# Altium project CubeSatTelemetry2.PrjPcb (part 1 of 2)
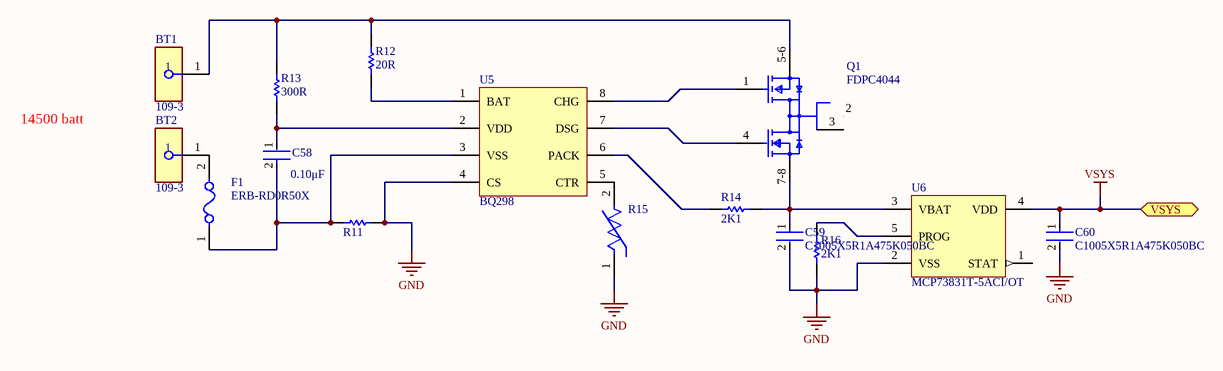
[diagram p0: BMS.SchDoc]
13 sheets, 176 parts. Net scope: hierarchical (ports join the sheet entries above them; power ports are global).
Board file: RocketModule.PcbDoc
Sheets:
  BMS.SchDoc
  TopLevel.SchDoc
    U_MCUsubsystem = MCUsubsystem.SchDoc
      U_MCUReset = MCUReset.SchDoc
    U_SerialConnector = SerialConnector.SchDoc
    U_LoRaSubsystem = LoRaSubsystem.SchDoc
    U_LTEMSubsystem = LTEMSubsystem.SchDoc
    U_MicroSDcard = MicroSDcard.SchDoc
    U_PowerSubsystem = PowerSubsystem.SchDoc
      Repeat(DCDC ,1,2)) = DCDC_Converter.SchDoc
    U_PreciseGNSS = PreciseGNSS.SchDoc
    U_RoughGNSS = RoughGNSS.SchDoc
    U_UWBSubsystem = UWBSubsystem.SchDoc

## Sheet BMS.SchDoc
size A4; SheetNumber: 9; SheetTotal: 14

### Parts
BT1  109-3  [FP-109-3-MFG]
BT2  109-3  [FP-109-3-MFG]
C58  Capacitance: 0.10μF  [FP-GRM15-MFG]  (hidden comment: GRM155R71C104KA88D)
C59  C1005X5R1A475K050BC  [FP-C1005-050-0_15-MFG]
C60  C1005X5R1A475K050BC  [FP-C1005-050-0_15-MFG]
F1  ERB-RD0R50X  [FP-ERBRD-MFG]
Q1  FDPC4044  [FP-483BP-MFG]
R11  ERJ-2BSFR10X  [RESC1005X40X27LL10T10]  (value not drawn)
R12  20R  [RESC1005X40X25LL05T10]
R13  300R  [RESC1005X35X20ML05T10]
R14  2K1  [RESC1005X40X25NL05T05]
R15  NCP15XH103F03RC  [FP-NCP15-NCU15-0_05-IPC_C]  (value not drawn)
R16  2K1  [RESC1005X40X25NL05T05]
U5  BQ298  [thingio]
U6  MCP73831T-5ACI/OT  [SOT-23-OT5_N]

### Ports
VSYS (bidir, see PowerSubsystem[2B], DCDC_Converter[2B])

### Nets
GND: C59.2 C60.2 R11.1 R15.1 R16.1 U5.4(CS) U6.2(VSS)
VSYS: C60.1 U6.4(VDD) ; port VSYS
NetBT1_1: BT1.1 Q1.5-6(S1) R12.2 R13.2
NetBT2_1: BT2.1 F1.2
NetC58_1: C58.1 R13.1 U5.2(VDD)
NetC58_2: C58.2 F1.1 R11.2 U5.3(VSS)
NetC59_1: C59.1 Q1.7-8(S2) R14.2 U6.3(VBAT)
NetQ1_1: Q1.1(G1) U5.8(CHG)
NetQ1_4: Q1.4(G2) U5.7(DSG)
NetR12_1: R12.1 U5.1(BAT)
NetR14_1: R14.1 U5.6(PACK)
NetR15_2: R15.2 U5.5(CTR)
NetR16_2: R16.2 U6.5(PROG)

Not connected (* = marked no-connect by the designer): Q1 2(D1) 3(D2); U6 1(STAT)

### Notes on the sheet
- 14500 batt

### Library data of the parts
BT1 BT2 = CMP-19636-000033-1: BATT CONTACT SPRING MULTI PC PIN; Number of Batteries: 2; Lead Free: Lead Free; Color: Black; Package Quantity: 100; Reach SVHC Compliant: Yes; Max Operating Temperature: 145°C; RoHS Compliant: Yes; Mount: Surface Mount; Termination: SMD/SMT; Min Operating Temperature: -50°C; Case/Package: SMD/SMT; Series: -
C58 = CMP-2100-03641-2: CAP CER 0.1UF 16V X7R 0402; Manufacturer: Murata; Standoff Height: 0mm; Tolerance: 10%; Voltage Rating: 16Vdc; Material: Ceramic; Value: 0.10μF; RoHS: TRUE; Manufacturer Part Number: GRM155R71C104KA88D; Temperature Characteristic: X7R; Octopart: https://octopart.com/grm155r71c104ka88d-murata-196880; Digikey Description: CAP CER 0.1UF 16V X7R 0402; Device Class L3: Ceramic Capacitors; Height: 0.55mm; ComponentLink2Description: Datasheet; Temperature Range Low: -55°C; Ipc Land Pattern Name: CAPC10050X219; ComponentLink2URL: https://search.murata.co.jp/Ceramy/image/img/A01X/G101/ENG/GRM155R71H471KA01-01A.pdf; Device Class L1: Passive Components; Lead Free: yes; Category: Cap; Package: GRM15; Temperature: -55°C to +125°C; Device Class L2: Capacitors; Temperature Range High: +125°C; Mouser Description: 0402 0.1 uF 16V ±10 % Tolerance X7R SMT Multilayer Ceramic Capacitor
C59 C60 = CMP-2000-05997-2: CAP CER 4.7UF 10V X5R 0402; Dielectric Material: Ceramic; Tolerance: 10%; Series: C; Package Quantity: 10000; Max Operating Temperature: 85°C; Case Code (Imperial): 0402; Lead Free: Lead Free; Voltage Rating (DC): 10V; Packaging: Cut Tape; Voltage Rating: 10V; Min Operating Temperature: -55°C; Dielectric: X5R; Thickness: 0.022inch; Width: 0.02inch; Case/Package: 0402; Case Code (Metric): 1005; Capacitance: 4.7uF; Length: 0.039inch; RoHS Compliant: Yes; REACH SVHC: No SVHC; Mount: Surface Mount
F1 = CMP-05590-000002-1: FUSE BOARD MNT 500MA 32VDC 0402; Manufacturer: Panasonic Electronic Components; Fuse Current: 0.5A; Fuse Blow Speed: Fast; Voltage Rating: 32V; Value: 310mΩ; Fuse Interrupt Dc Current: 35A; Description: 500mA AC 32V DC Fuse Board Mount (Cartridge Style Excluded) Surface Mount 0402 (1005 Metric); RoHS: TRUE; ComponentLink2Description: Datasheet; Temperature Range High: +125°C; Temperature: -40°C to +125°C; Mouser Description: Fuse Chip Fast Acting 0.5A 32V SMD Solder Pad 0402 1 X 0.5 X 0.39mm T/R UL/cUL; Digikey Description: FUSE BOARD MNT 500MA 32VDC 0402; Device Class L2: Fuses; Temperature Range Low: -40°C; Ipc Land Pattern Name: CAPC10050X39; Octopart: https://octopart.com/erb-rd0r50x-panasonic-21220527; Category: Fuse; Automotive: No; Device Class L3: unset; Lead Free: Yes; Package: ERBRD; Max Fuse Dc Voltage: 32V; Device Class L1: Circuit Protection; Manufacturer Part Number: ERB-RD0R50X; ComponentLink2URL: https://industrial.panasonic.com/cdbs/www-data/pdf/AFA0000/AFA0000C7.pdf; Height: 0.49mm; Resistance: 310mΩ
Q1 = CMP-07173-000013-1: MOSFET 2N-CH 8MLP; Manufacturer: ON Semiconductor; Max Forward Diode Voltage: 1.2V; Transconductance: 150S; Power Dissipation: 1W; Typ Forward Diode Voltage: 0.8V; Depletion Mode: False; Drain To Source Resistance: 3.2mΩ; Drain To Source Breakdown Voltage: 30V; Number Of N Channels: 2; Turn Off Delay Time: 32ns; Continuous Drain Current: 27A; Threshold Vgs Max: 3V; Turn On Delay Time: 8.5ns; Gate To Source Voltage: 20V; Max Junction Temp: +150°C; Standoff Height: 0mm; Rthja Max: 127°C/W; Gate Charge At Vgs: 35nC @ 10V; Mouser Description: MOSFET Common Drain N-Chan Power Trench MOSFET; Package: 483BP; Octopart: https://octopart.com/fdpc4044-on+semiconductor-84326487; Footprint Url: https://www.onsemi.com/pub/Collateral/483BP.PDF; Device Class L2: Transistors; Temperature Range Low: -55°C; Device Class L1: Discrete Semiconductors; Number Of Channels: 2; Temperature: -55°C to +150°C; Category: Trans; Manufacturer Part Number: FDPC4044; RoHS: TRUE; Device Class L3: MOSFETs; Height: 0.8mm; Temperature Range High: +150°C; Lead Free: Yes; ComponentLink2URL: https://www.onsemi.com/pub/Collateral/FDPC4044-D.PDF; Automotive: No; Threshold Vgs Min: 1.2V; ComponentLink2Description: Datasheet; Digikey Description: MOSFET 2N-CH 8MLP
R11 = CMP-2002-04635-1: Manufacturer: Panasonic; Part Number: ERJ-2BSFR10X
R12 = CMP-2002-07502-1: Part Number: RC0402FR-0720RL; Manufacturer: Yageo / Phycomp
R13 = CMP-2002-03249-1: Part Number: CPF0402B300RE1; Manufacturer: TE Connectivity / AMP
R14 R16 = CMP-2002-08450-1: Part Number: CRCW04022K10FKED; Manufacturer: Vishay Dale
R15 = CMP-06022-000003-3: NTC Thermistor for Temperature Sensor, 0402, 10kΩ, 1%, 0.1mA, 5V; Max Power Dissipation: 100mW; Resistance: 10kR; Current Rating: 310uA; Length: 1mm; Min Operating Temperature: -40°C; Max Operating Temperature: 125°C; Resistance Tolerance: 1%; Lead Free: Lead Free; Radiation Hardening: No; Case Code (Imperial): 0402; Depth: 0.5mm; Tolerance: 1%; Packaging: Tape and Reel; Package Quantity: 10000; Series: NCP; Number of Pins: 2; Power Rating: 100mW; Case/Package: 0402; Case Code (Metric): 1005; Height: 0.5mm; Termination: SMD/SMT; RoHS Compliant: Yes; REACH SVHC: No SVHC; Mount: Surface Mount
U5 = BQ298: BQ298xyz Voltage, Current, Temperature Protectors with an Integrated High-Side / NFET Driver for Fast/Flash Charging Single-Cell Li-Ion and Li-Polymer Batteries
U6 = CMP-0133-00136-1: Miniature Single-Cell, Fully Integrated Li-Ion, Li-Polymer Charge Management Controller, 4.5V, 5-Pin SOT-23, Industrial Temperature, Tape and Reel; PackageReference: SOT-23-OT5; PackageDescription: 5-Lead Plastic Small Outline Transistor (OT) [SOT-23]; PackageVersion: revBB, Aug-2009; DatasheetVersion: revE, Sep-2008; Code_IPC: SOT23-5

## Sheet TopLevel.SchDoc
size A4; SheetNumber: 1; SheetTotal: 13
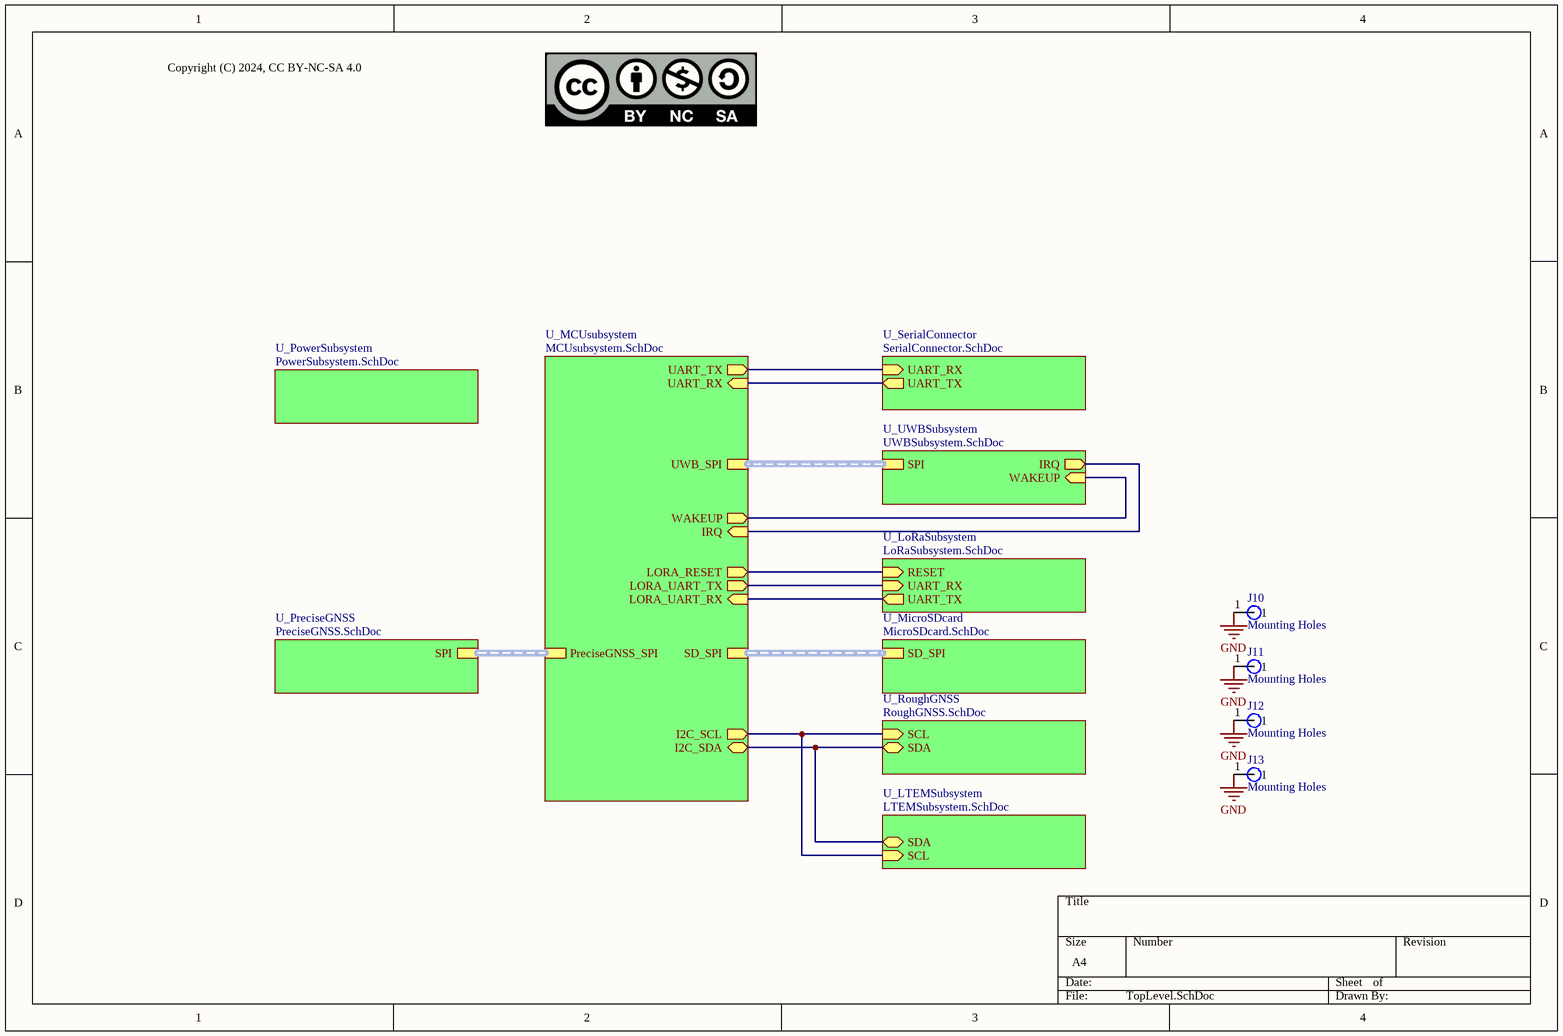
[diagram p1: TopLevel.SchDoc]

### Parts
J10  Mounting Holes  [Mounting Hole]
J11  Mounting Holes  [Mounting Hole]
J12  Mounting Holes  [Mounting Hole]
J13  Mounting Holes  [Mounting Hole]

### Sub-sheets
U_LoRaSubsystem = LoRaSubsystem.SchDoc: UART_RX (in), UART_TX (out), RESET (in)
U_LTEMSubsystem = LTEMSubsystem.SchDoc: SDA (bidir), SCL (in)
U_MCUsubsystem = MCUsubsystem.SchDoc: UART_RX (in), UART_TX (out), UWB_SPI (harness SPI), LORA_UART_TX (out), LORA_UART_RX (in), PreciseGNSS_SPI (harness SPI), SD_SPI (harness SPI), LORA_RESET (out), I2C_SDA (bidir), I2C_SCL (out), WAKEUP (out), IRQ (in)
U_MicroSDcard = MicroSDcard.SchDoc: SD_SPI (harness SPI)
U_PowerSubsystem = PowerSubsystem.SchDoc: no entries
U_PreciseGNSS = PreciseGNSS.SchDoc: SPI (harness SPI)
U_RoughGNSS = RoughGNSS.SchDoc: SCL (in), SDA (bidir)
U_SerialConnector = SerialConnector.SchDoc: UART_RX (in), UART_TX (out)
U_UWBSubsystem = UWBSubsystem.SchDoc: SPI (harness SPI), IRQ (out), WAKEUP (in)

### Nets
GND: J10.1 J11.1 J12.1 J13.1
NetMD2_2: sheet U_MCUsubsystem/WAKEUP, sheet U_UWBSubsystem/WAKEUP
NetMD2_22: sheet U_MCUsubsystem/IRQ, sheet U_UWBSubsystem/IRQ
NetP1_1: sheet U_MCUsubsystem/UART_RX, sheet U_SerialConnector/UART_TX
NetR26_1: sheet U_MCUsubsystem/LORA_UART_TX, sheet U_LoRaSubsystem/UART_RX
NetR27_2: sheet U_MCUsubsystem/LORA_RESET, sheet U_LoRaSubsystem/RESET
NetR28_1: sheet U_MCUsubsystem/LORA_UART_RX, sheet U_LoRaSubsystem/UART_TX
NetR39_2: sheet U_MCUsubsystem/I2C_SDA, sheet U_LTEMSubsystem/SDA, sheet U_RoughGNSS/SDA
NetR40_2: sheet U_MCUsubsystem/I2C_SCL, sheet U_LTEMSubsystem/SCL, sheet U_RoughGNSS/SCL
NetU1#1_39: sheet U_MCUsubsystem/UART_TX, sheet U_SerialConnector/UART_RX

### Buses and harness runs
harness sheet U_MCUsubsystem/PreciseGNSS_SPI = sheet U_PreciseGNSS/SPI
harness sheet U_MCUsubsystem/SD_SPI = sheet U_MicroSDcard/SD_SPI
harness sheet U_MCUsubsystem/UWB_SPI = sheet U_UWBSubsystem/SPI

### Notes on the sheet
- Copyright (C) 2024, CC BY-NC-SA 4.0

## Sheet MCUsubsystem.SchDoc
size A3; SheetNumber: 4; SheetTotal: 13
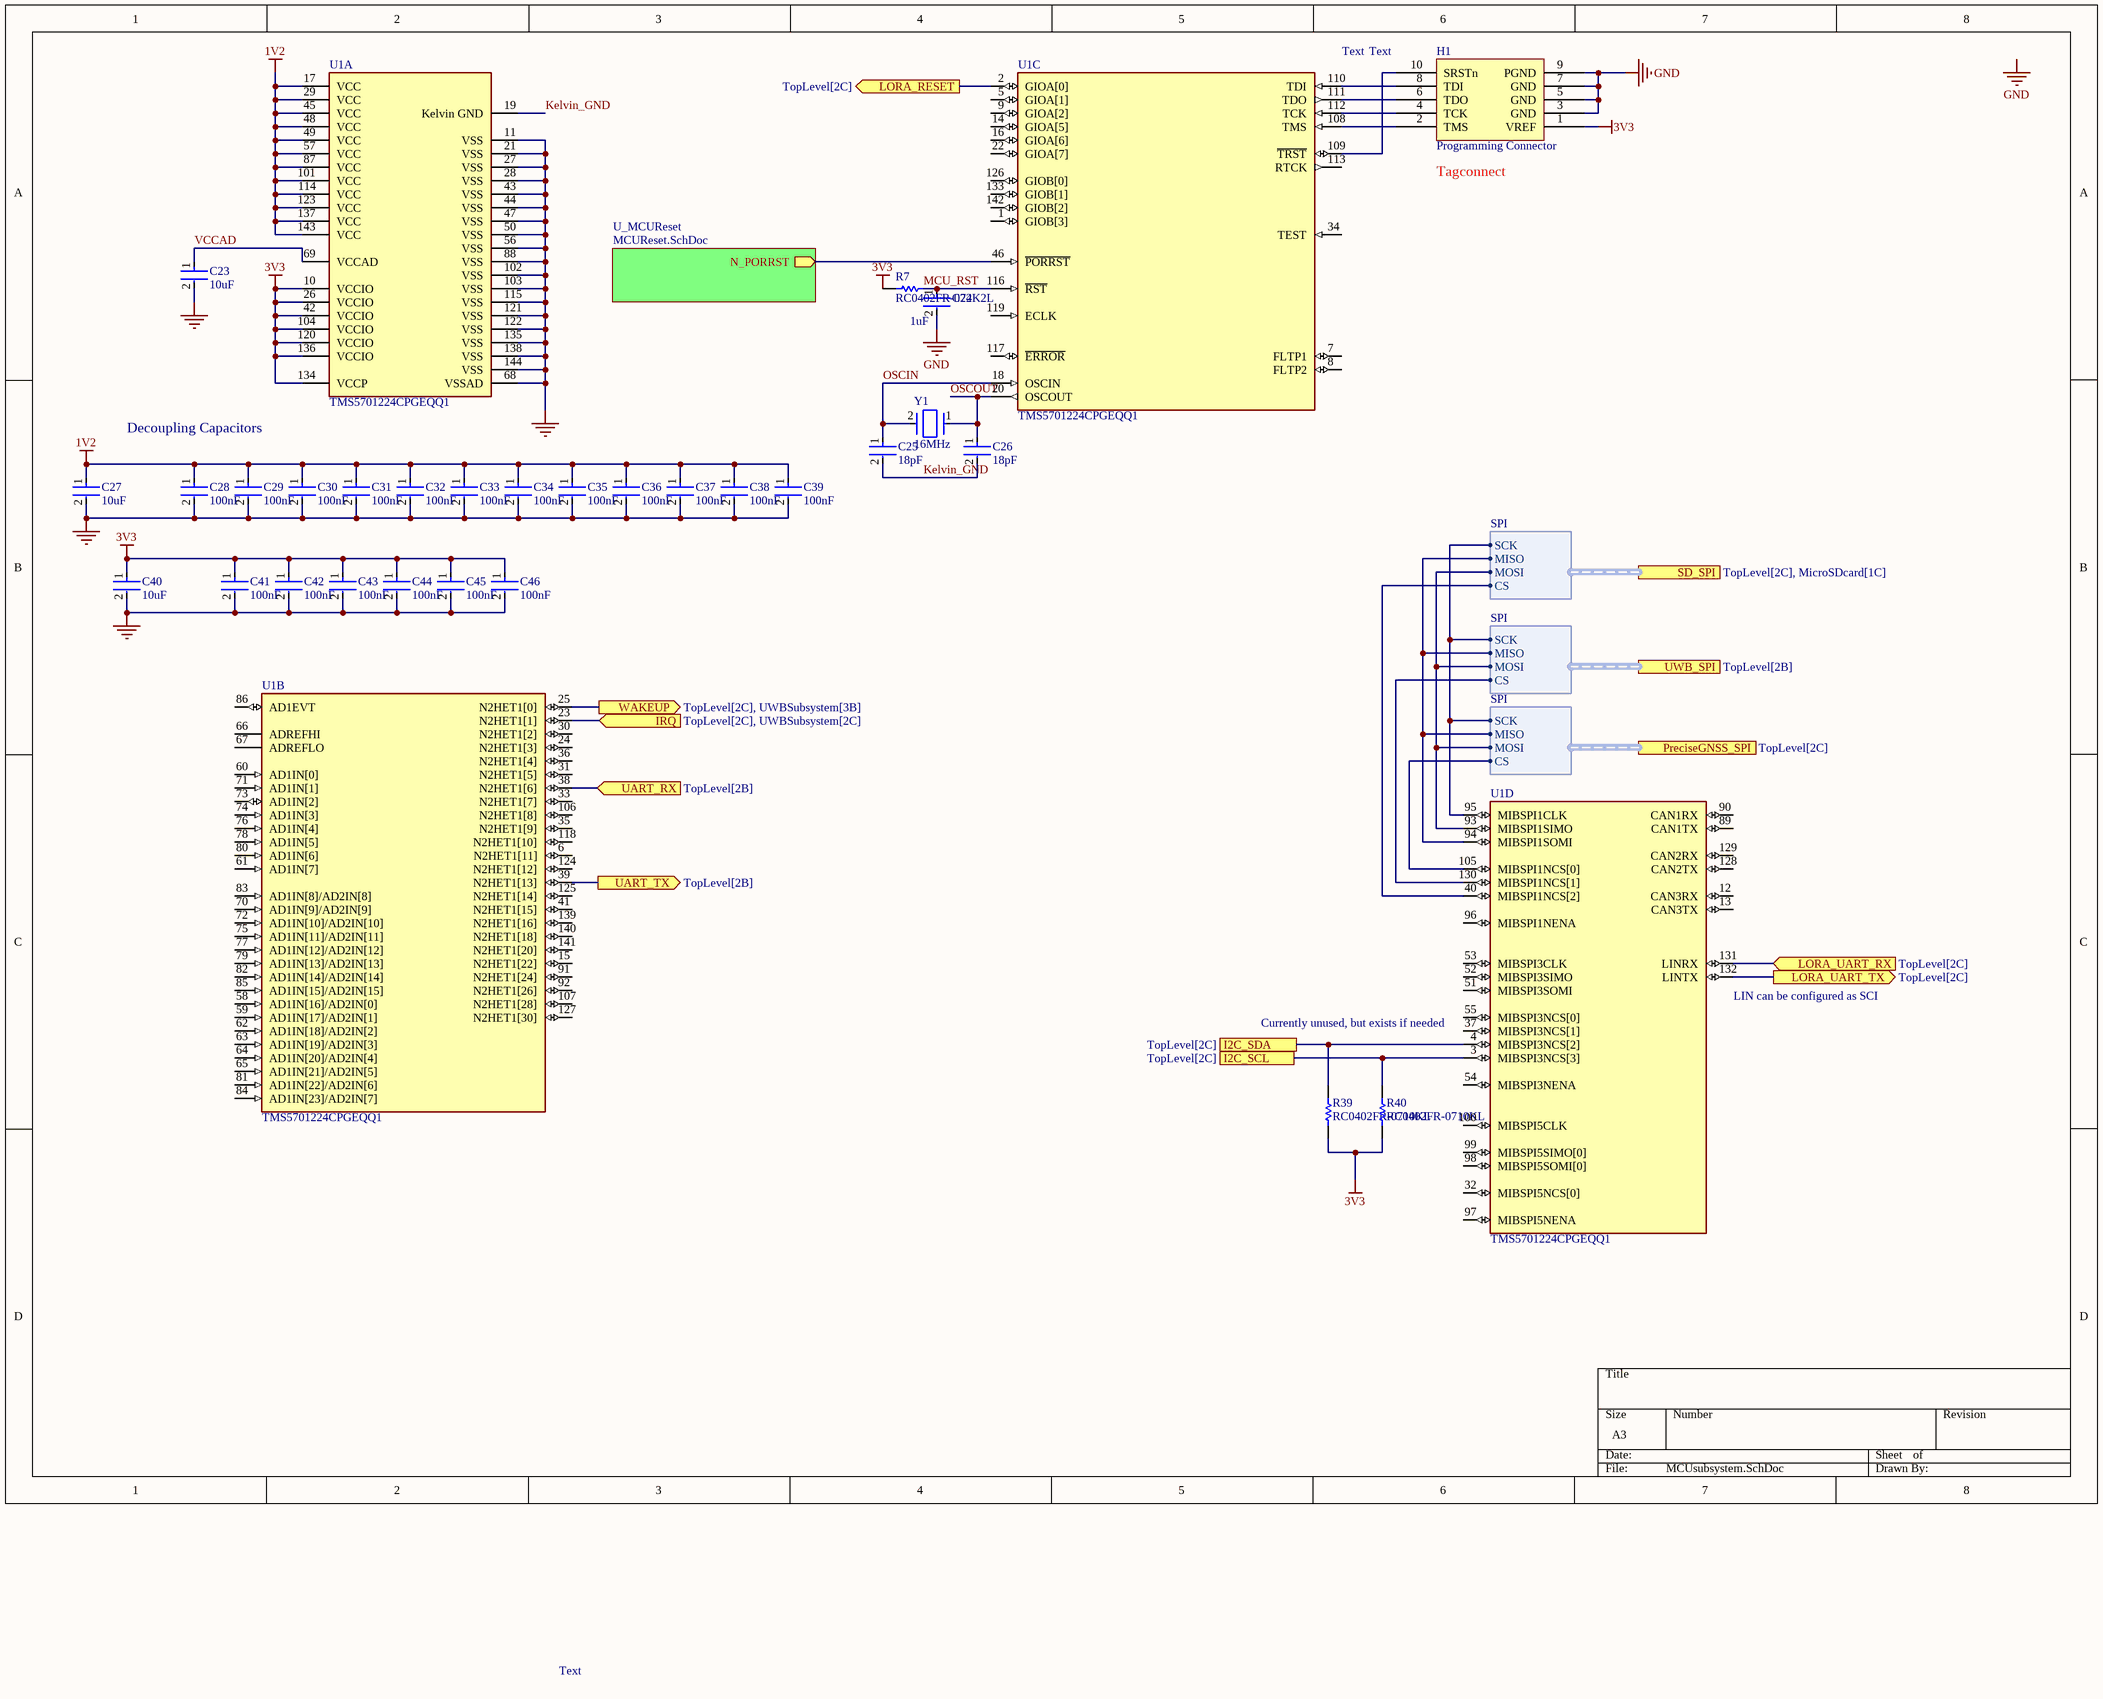
[diagram p2: MCUsubsystem.SchDoc]

### Parts
(Parts that share a designator on the sheet are numbered #1, #2 ... from top to bottom, then left to right.)
C23  10uF  [FP-GRM188-0_2-MFG]
C24  Capacitance: 1uF  [FP-CL511-IPC_C]  (hidden comment: CL05A105KP5NNNC)
C25  18pF  [FP-C0402-BB-MFG]
C26  18pF  [FP-C0402-BB-MFG]
C27  10uF  [FP-GRM188-0_2-MFG]
C28  100nF  [FP-GRM033-0_03-IPC_C]
C29  100nF  [FP-GRM033-0_03-IPC_C]
C30  100nF  [FP-GRM033-0_03-IPC_C]
C31  100nF  [FP-GRM033-0_03-IPC_C]
C32  100nF  [FP-GRM033-0_03-IPC_C]
C33  100nF  [FP-GRM033-0_03-IPC_C]
C34  100nF  [FP-GRM033-0_03-IPC_C]
C35  100nF  [FP-GRM033-0_03-IPC_C]
C36  100nF  [FP-GRM033-0_03-IPC_C]
C37  100nF  [FP-GRM033-0_03-IPC_C]
C38  100nF  [FP-GRM033-0_03-IPC_C]
C39  100nF  [FP-GRM033-0_03-IPC_C]
C40  10uF  [FP-GRM188-0_2-MFG]
C41  100nF  [FP-GRM033-0_03-IPC_C]
C42  100nF  [FP-GRM033-0_03-IPC_C]
C43  100nF  [FP-GRM033-0_03-IPC_C]
C44  100nF  [FP-GRM033-0_03-IPC_C]
C45  100nF  [FP-GRM033-0_03-IPC_C]
C46  100nF  [FP-GRM033-0_03-IPC_C]
H1  Programming Connector  [TC2050-IDC]  (no BOM)
R7  RC0402FR-072K2L  [RESC1005X40X25NL05T10]
R39  RC0402FR-0710KL  [RESC1005X40X25LL05T10]
R40  RC0402FR-0710KL  [RESC1005X40X25LL05T10]
U1#1  TMS5701224CPGEQQ1  [FP-PGE0144A-IPC_C]  (parts A,B,C,D of 4)
Y1  16MHz  [FP-ABM7-MFG]

### Sub-sheets
U_MCUReset = MCUReset.SchDoc: N_PORRST (out)

### Ports
I2C_SCL (see TopLevel[2C]), I2C_SDA (see TopLevel[2C]), IRQ (in, see TopLevel[2C], UWBSubsystem[2C]), LORA_RESET (out, see TopLevel[2C]), LORA_UART_RX (in, see TopLevel[2C]), LORA_UART_TX (out, see TopLevel[2C]), PreciseGNSS_SPI (harness SPI, see TopLevel[2C]), SD_SPI (harness SPI, see TopLevel[2C], MicroSDcard[1C]), UART_RX (in, see TopLevel[2B]), UART_TX (out, see TopLevel[2B]), UWB_SPI (harness SPI, see TopLevel[2B]), WAKEUP (out, see TopLevel[2C], UWBSubsystem[3B])

### Harnesses
SPI: SCK, MISO, MOSI, CS

### Nets
1V2: C27.1 C28.1 C29.1 C30.1 C31.1 C32.1 C33.1 C34.1 C35.1 C36.1 C37.1 C38.1 C39.1 U1#1.17(VCC) U1#1.29(VCC) U1#1.45(VCC) U1#1.48(VCC) U1#1.49(VCC) U1#1.57(VCC) U1#1.87(VCC) U1#1.101(VCC) U1#1.114(VCC) U1#1.123(VCC) U1#1.137(VCC) U1#1.143(VCC)  [project net VOUT2]
3V3: C40.1 C41.1 C42.1 C43.1 C44.1 C45.1 C46.1 H1.1(VREF) R7.2 R39.1 R40.1 U1#1.10(VCCIO) U1#1.26(VCCIO) U1#1.42(VCCIO) U1#1.104(VCCIO) U1#1.120(VCCIO) U1#1.134(VCCP) U1#1.136(VCCIO)  [project net GPIO_VDD]
GND: C23.2 C24.2 C27.2 C28.2 C29.2 C30.2 C31.2 C32.2 C33.2 C34.2 C35.2 C36.2 C37.2 C38.2 C39.2 C40.2 C41.2 C42.2 C43.2 C44.2 C45.2 C46.2 H1.3(GND) H1.5(GND) H1.7(GND) H1.9(PGND) U1#1.11(VSS) U1#1.21(VSS) U1#1.27(VSS) U1#1.28(VSS) U1#1.43(VSS) U1#1.44(VSS) U1#1.47(VSS) U1#1.50(VSS) U1#1.56(VSS) U1#1.68(VSSAD) U1#1.88(VSS) U1#1.102(VSS) U1#1.103(VSS) U1#1.115(VSS) U1#1.121(VSS) U1#1.122(VSS) U1#1.135(VSS) U1#1.138(VSS) U1#1.144(VSS)
Kelvin_GND: C25.2 C26.2 U1#1.19(Kelvin_GND)
MCU_RST: C24.1 R7.1 U1#1.116(~{RST})
OSCIN: C25.1 U1#1.18(OSCIN) Y1.2
OSCOUT: C26.1 U1#1.20(OSCOUT) Y1.1
VCCAD: C23.1 U1#1.69(VCCAD)
NetH1_2: H1.2(TMS) U1#1.108(TMS)
NetH1_4: H1.4(TCK) U1#1.112(TCK)
NetH1_6: H1.6(TDO) U1#1.111(TDO)
NetH1_8: H1.8(TDI) U1#1.110(TDI)
NetH1_10: H1.10(SRSTn) U1#1.109(~{TRST})
NetJ4_2: U1#1.40(MIBSPI1NCS[2]) ; port SD_SPI.CS
NetJ4_3: U1#1.93(MIBSPI1SIMO) ; port UWB_SPI.MOSI, port PreciseGNSS_SPI.MOSI, port SD_SPI.MOSI
NetJ4_5: U1#1.95(MIBSPI1CLK) ; port UWB_SPI.SCK, port PreciseGNSS_SPI.SCK, port SD_SPI.SCK
NetJ4_7: U1#1.94(MIBSPI1SOMI) ; port UWB_SPI.MISO, port PreciseGNSS_SPI.MISO, port SD_SPI.MISO
NetMD1_44: U1#1.105(MIBSPI1NCS[0]) ; port PreciseGNSS_SPI.CS
NetMD2_2: U1#1.25(N2HET1[0]) ; port WAKEUP
NetMD2_17: U1#1.130(MIBSPI1NCS[1]) ; port UWB_SPI.CS
NetMD2_22: U1#1.23(N2HET1[1]) ; port IRQ
NetP1_1: U1#1.38(N2HET1[6]) ; port UART_RX
NetR19_1: U1#1.46(~{PORRST}) ; sheet U_MCUReset/N_PORRST
NetR26_1: U1#1.132(LINTX) ; port LORA_UART_TX
NetR27_2: U1#1.2(GIOA[0]) ; port LORA_RESET
NetR28_1: U1#1.131(LINRX) ; port LORA_UART_RX
NetR39_2: R39.2 U1#1.4(MIBSPI3NCS[2]) ; port I2C_SDA
NetR40_2: R40.2 U1#1.3(MIBSPI3NCS[3]) ; port I2C_SCL
NetU1#1_39: U1#1.39(N2HET1[13]) ; port UART_TX

Not connected (* = marked no-connect by the designer): U1#1 1(GIOB[3]) 5(GIOA[1]) 6(N2HET1[11]) 7(FLTP1) 8(FLTP2) 9(GIOA[2]) 12(CAN3RX) 13(CAN3TX) 14(GIOA[5]) 15(N2HET1[22]) 16(GIOA[6]) 22(GIOA[7]) 24(N2HET1[3]) 30(N2HET1[2]) 31(N2HET1[5]) 32(MIBSPI5NCS[0]) 33(N2HET1[7]) 34(TEST) 35(N2HET1[9]) 36(N2HET1[4]) 37(MIBSPI3NCS[1]) 41(N2HET1[15]) 51(MIBSPI3SOMI) 52(MIBSPI3SIMO) 53(MIBSPI3CLK) 54(MIBSPI3NENA) 55(MIBSPI3NCS[0]) 58(AD1IN[16]/AD2IN[0]) 59(AD1IN[17]/AD2IN[1]) 60(AD1IN[0]) 61(AD1IN[7]) 62(AD1IN[18]/AD2IN[2]) 63(AD1IN[19]/AD2IN[3]) 64(AD1IN[20]/AD2IN[4]) 65(AD1IN[21]/AD2IN[5]) 66(ADREFHI) 67(ADREFLO) 70(AD1IN[9]/AD2IN[9]) 71(AD1IN[1]) 72(AD1IN[10]/AD2IN[10]) 73(AD1IN[2]) 74(AD1IN[3]) 75(AD1IN[11]/AD2IN[11]) 76(AD1IN[4]) 77(AD1IN[12]/AD2IN[12]) 78(AD1IN[5]) 79(AD1IN[13]/AD2IN[13]) 80(AD1IN[6]) 81(AD1IN[22]/AD2IN[6]) 82(AD1IN[14]/AD2IN[14]) 83(AD1IN[8]/AD2IN[8]) 84(AD1IN[23]/AD2IN[7]) 85(AD1IN[15]/AD2IN[15]) 86(AD1EVT) 89(CAN1TX) 90(CAN1RX) 91(N2HET1[24]) 92(N2HET1[26]) 96(MIBSPI1NENA) 97(MIBSPI5NENA) 98(MIBSPI5SOMI[0]) 99(MIBSPI5SIMO[0]) 100(MIBSPI5CLK) 106(N2HET1[8]) 107(N2HET1[28]) 113(RTCK) 117(~{ERROR}) 118(N2HET1[10]) 119(ECLK) 124(N2HET1[12]) 125(N2HET1[14]) 126(GIOB[0]) 127(N2HET1[30]) 128(CAN2TX) 129(CAN2RX) 133(GIOB[1]) 139(N2HET1[16]) 140(N2HET1[18]) 141(N2HET1[20]) 142(GIOB[2])

### Notes on the sheet
- (near U1#1) Text
- Text
- (near H1) Tagconnect
- Decoupling Capacitors
- (near U1#1) Currently unused, but exists if needed
- (near U1#1) LIN can be configured as SCI
- Labels drawn without touching a wire or pin: GND

### Library data of the parts
C23 C27 C40 = CMP-06035-002932-1: Chip Multilayer Ceramic Capacitors for General Purpose, 0603, 10uF, X6S, 22%, 20%, 10V; Case Code (Metric): 1608; Max Operating Temperature: 105°C; Voltage Rating (DC): 10V; Thickness: 0.031inch; Width: 0.031inch; Dielectric: X6S; Lead Free: Lead Free; REACH SVHC: No SVHC; Case/Package: 0603; Length: 0.063inch; Min Operating Temperature: -55°C; Package Quantity: 4000; Voltage Rating: 10V; Tolerance: 20%; Capacitance: 10uF; Packaging: Cut Tape; Material: Ceramic; Mount: Surface Mount; Case Code (Imperial): 0603; Height: 0.8mm
C24 = CMP-13271-001936-1: Cap Ceramic 1uF 10V X5R ±10% SMD 0402 +85°C Paper T/R; Depth: 0.5mm; Case Code (Imperial): 0402; Material: Ceramic; Mount: Surface Mount; Thickness: 0.022inch; Dielectric: X5R; Radiation Hardening: No; Case/Package: 0402; Length: 1mm; Tolerance: 10%; Max Operating Temperature: 85°C; Package Quantity: 1; Width: 0.02inch; Voltage Rating: 10V; Contact Plating: Tin; Height: 0.5mm; Min Operating Temperature: -55°C; Case Code (Metric): 1005; Packaging: Tape and Reel
C25 C26 = CMP-2008-03345-2: CAP CER 18PF 25V C0G/NP0 0402; Manufacturer Part Number: C0402C180J3GACTU; Manufacturer: Kemet; Material: Ceramic; Temperature Characteristic: C0G; Tolerance: 0.05; Temperature Coefficient: 15%; Temperature Range High: +125°C; Temperature: -55°C to +125°C; Voltage Rating: 25 V; Ipc Land Pattern Name: CAPC10050X50; Temperature Range Low: -55°C; Digikey Description: CAP CER 18PF 25V C0G/NP0 0402; Package: C0402-BB; Octopart: https://octopart.com/c0402c180j3gactu-kemet-12569103; Device Class L3: Ceramic Capacitors; Category: Cap; Automotive: No; Capacitance: 18 pF; Height: 0.55mm; RoHS: TRUE; ComponentLink2Description: Datasheet; Mouser Description: Multilayer Ceramic Capacitors MLCC - SMD/SMT 25volts 18pF C0G 5%; Value: 18 pF; Device Class L1: Passive Components; ComponentLink2URL: https://content.kemet.com/datasheets/KEM_C1002_X7R_SMD.pdf; Device Class L2: Capacitors; Lead Free: Yes
C28-C39 C41-C46 = CMP-2010-01264-2: Chip Multilayer Ceramic Capacitors for General Purpose, 0201, 0.10uF, X5R, 15%, 10%, 10V; Mount: Surface Mount; Dielectric: X5R; Width: 0.012inch; Tolerance: 10%; Radiation Hardening: No; Voltage Rating: 10V; REACH SVHC: No SVHC; Height: 0.3mm; Max Operating Temperature: 85°C; Voltage Rating (DC): 10V; Capacitance: 100nF; Thickness: 0.013inch; Termination: SMD/SMT; Lead Free: Lead Free; Package Quantity: 1; Case/Package: 0201; Min Operating Temperature: -55°C; Weight: 6E-06oz; Length: 0.6mm; Case Code (Imperial): 0201; Depth: 0.3mm; Voltage: 10V; Packaging: Tape and Reel; Case Code (Metric): 0603
H1 = CMP-CONN-00032-12: Header, JTAG 10-pin dual row programming connector; Value: 10 pin; Type: Debug Port; Design Item ID: CNNR00036; System: Connector
R7 = CMP-2002-07567-1: Manufacturer: Yageo / Phycomp; Part Number: RC0402FR-072K2L
R39 R40 = CMP-2002-07353-1: Manufacturer: Yageo / Phycomp; Part Number: RC0402FR-0710KL
U1#1 = CMP-04869-000009-2: TMS570LS1224 ACTIVE 16/32 Bit RISC Flash MCU, Cortex R4F, Auto Q10032-Bit RISC Flash Microcontroller; Manufacturer: Texas Instruments; Number Of A/D Converters: 2; Number Of Spi Channels: 3; Number Of Timers/Counters: 24; Max Junction Temp: +150°C; Number Of I/Os: 64; Core Architecture: ARM Cortex-R4F; Memory Size: 1280KBytes; Min Supply Voltage: 1.14V; Frequency: 160MHz; Data Bus Width: 32bits; Number Of I2C Channels: 1; Max Supply Voltage: 5.25V; Standoff Height: 0.05mm; Number Of Pwm Channels: 14; Interface: I2C,SPI,UART,CAN,LIN,SCI,Other; Ram Size: 192KBytes; Automotive Grade: Grade 1; Package: PGE0144A; Ambient Temperature Range Low: -40°C; Number Of Uart Channels: 2; Device Class L1: Integrated Circuits (ICs); Memory Type: FLASH; Number Of Cores: 2; Category: IC; Temperature: -40°C to +125°C; Device Class L3: Microcontrollers; Temperature Range High: +125°C; RoHS: TRUE; Height: 1.6mm; ComponentLink2URL: http://www.ti.com/lit/ds/symlink/tms570ls1224.pdf; Ambient Temperature Range High: +125°C; Temperature Range Low: -40°C; Device Class L2: Embedded Processors and Controllers; Lead Free: Yes; Number Of Adc Channels: 24; Octopart: https://octopart.com/tms5701224cpgeqq1-texas+instruments-61765979; ComponentLink2Description: Datasheet; Manufacturer Part Number: TMS5701224CPGEQQ1; Automotive: Yes
Y1 = CMP-27762-000095-1: Crystal 16MHz ±20ppm 18pF SMD-2 6mm x 3.5mm; ESR (Equivalent Series Resistance): 50R; Frequency Stability: 30ppm; Width: 3.3mm; Frequency: 16MHz; Radiation Hardening: No; Height: 0.055inch; Tolerance: 20ppm; Length: 6mm; Case/Package: CSMD; Lead Free: Lead Free; Min Operating Temperature: -40°C; Termination: SMD/SMT; Operating Frequency: 16 MHz; Resistor Type: Ceramic; Packaging: Tape and Reel; Mount: Surface Mount; Load Capacitance: 18pF; Frequency Tolerance: 20ppm; Depth: 3.5mm; Series: ABM7; Package Quantity: 1000; Max Operating Temperature: 85°C; Number of Pins: 2

## Sheet MCUReset.SchDoc
size A4; SheetNumber: 6; SheetTotal: 14
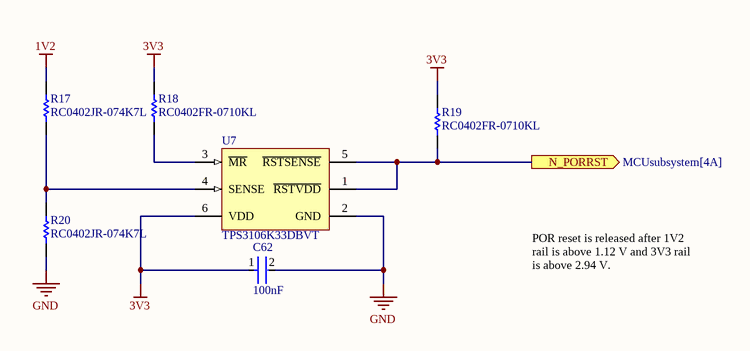
[diagram p3: MCUReset.SchDoc]

### Parts
C62  Capacitance: 100nF  [FP-GRM155-0_05-IPC_C]  (hidden comment: GRM155R71E104KE14J)
R17  RC0402JR-074K7L  [RESC1005X40X25LL05T10]
R18  RC0402FR-0710KL  [RESC1005X40X25LL05T10]
R19  RC0402FR-0710KL  [RESC1005X40X25LL05T10]
R20  RC0402JR-074K7L  [RESC1005X40X25LL05T10]
U7  TPS3106K33DBVT  [DBV0006A_N]

### Ports
N_PORRST (out, see MCUsubsystem[4A])

### Nets
1V2: R17.2  [project net VOUT2]
3V3: C62.1 R18.2 R19.2 U7.6(VDD)  [project net GPIO_VDD]
GND: C62.2 R20.1 U7.2(GND)
NetR17_1: R17.1 R20.2 U7.4(SENSE)
NetR18_1: R18.1 U7.3(~{MR})
NetR19_1: R19.1 U7.1(~{RSTVDD}) U7.5(~{RSTSENSE}) ; port N_PORRST

### Notes on the sheet
- POR reset is released after 1V2 rail is above 1.12 V and 3V3 rail is above 2.94 V.

### Library data of the parts
C62 = CMP-06035-003995-1: Chip Multilayer Ceramic Capacitors for General Purpose, 0402, 0.10uF, X7R, 15%, 10%, 25V; Resistor Type: Ceramic; Tolerance: 10%; Case Code (Metric): 1005; Termination: SMD/SMT; Mount: Surface Mount; Voltage Rating: 25V; Voltage Rating (DC): 25V; Case Code (Imperial): 0402; Max Operating Temperature: 125°C; Weight: 0.000212oz; Case/Package: 0402; Length: 0.039inch; Width: 0.5mm; Thickness: 0.022inch; Height: 0.5mm; Packaging: Tape and Reel; Package Quantity: 50000; Min Operating Temperature: -55°C; Dielectric: X7R
R17 R20 = CMP-2002-08011-1: Manufacturer: Yageo / Phycomp; Part Number: RC0402JR-074K7L
R18 R19 = CMP-2002-07353-1: Manufacturer: Yageo / Phycomp; Part Number: RC0402FR-0710KL
U7 = CMP-0332-00579-2: Ultra Low-Supply Current / Supply-Voltage Supervisory Circuit, 2 Supply Monitored, -40 to 85 degC, 6-pin SOT-23 (DBV), Green (RoHS & no Sb/Br); Manufacturer: Texas Instruments; VCC(Max)(V): 3.3; Rating: Catalog; Threshold Voltage 2 (typ)(Typ)(V): Adjustable; Reset Threshold Accuracy(%): 0.75; SubFamily: Supervisor and Reset IC; # of Supplies Monitored: 2; Time Delay(ms): 130; Threshold Voltage 1 (typ)(Typ)(V): 2.941; Output Driver Type / Reset Output: Active-low, Open-drain; VCC(Min)(V): 0.4; Iq(Typ)(uA): 1.2; ComponentLink1Description: Datasheet; PackageReference: DBV0006A; Code_JEDEC: MO-178-AB*; PackageVersion: revK, Mar-2006; DatasheetVersion: SLVS363E; Mounting Technology: Surface Mount; PackageDescription: 6-Pin Plastic Small-Outline Package, 2.9 x 1.6 mm Body, 0.95 mm Pitch, 2.8 mm Lead Span; ComponentLink1URL: http://www.ti.com/general/docs/lit/getliterature.tsp?genericPartNumber=TPS3106K33&fileType=pdf; PartNumber: TPS3106K33DBVT

## Sheet SerialConnector.SchDoc
size A4; SheetNumber: 12; SheetTotal: 13
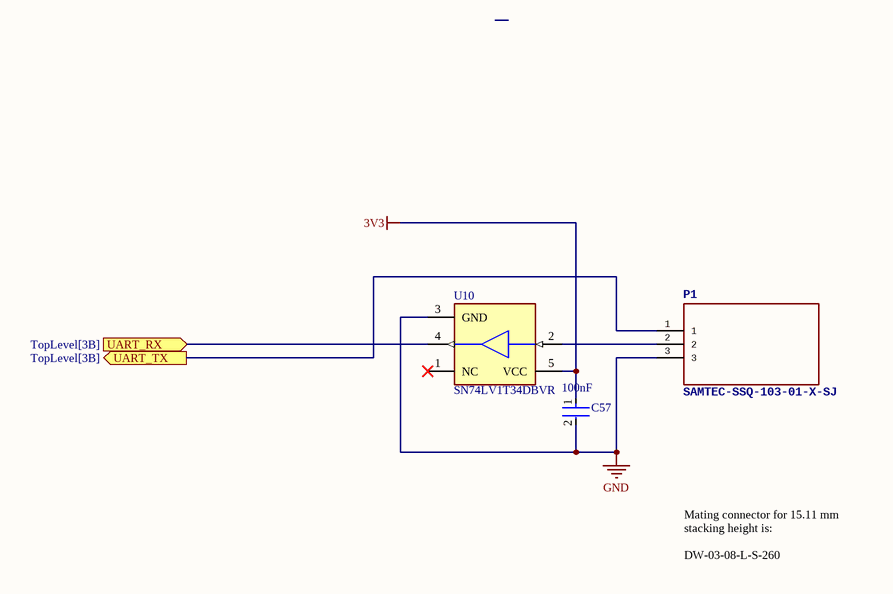
[diagram p4: SerialConnector.SchDoc]

### Parts
C57  Capacitance: 100nF  [FP-GRM155-0_05-IPC_C]  (hidden comment: GRM155R71E104KE14J)
P1  SAMTEC-SSQ-103-01-X-SJ  [SAMTEC-SSQ-103-01-X-S]
U10  SN74LV1T34DBVR  [FP-DBV0005A-IPC_B]

### Ports
UART_RX (in, see TopLevel[3B]), UART_TX (out, see TopLevel[3B])

### Nets
3V3: C57.1 U10.5(VCC)  [project net GPIO_VDD]
GND: C57.2 P1.3 U10.3(GND)
NetP1_1: P1.1 ; port UART_TX
NetP1_2: P1.2 U10.2(A)
NetU1#1_39: U10.4(Y) ; port UART_RX

Not connected (* = marked no-connect by the designer): U10 1(NC)*

### Notes on the sheet
- Mating connector for 15.11 mm stacking height is:
  DW-03-08-L-S-260

### Library data of the parts
C57 = CMP-06035-003995-1: as C62 on sheet MCUReset; Resistor Type: Ceramic; Tolerance: 10%; Case Code (Metric): 1005; Termination: SMD/SMT; Mount: Surface Mount; Voltage Rating: 25V; Voltage Rating (DC): 25V; Case Code (Imperial): 0402; Max Operating Temperature: 125°C; Weight: 0.000212oz; Case/Package: 0402; Length: 0.039inch; Width: 0.5mm; Thickness: 0.022inch; Height: 0.5mm; Packaging: Tape and Reel; Package Quantity: 50000; Min Operating Temperature: -55°C; Dielectric: X7R
U10 = CMP-0859-00123-4: IC BUF NON-INVERT 5.5V SOT23-5; Low Level Output Current: 8mA; Polarity: Non-Inverting; Number of Channels: 1; Propagation Delay: 15.5ns; High Level Output Current: -8mA; Quiescent Current: 1uA; Logic Function: Buffer; Min Supply Voltage: 1.6V; Min Operating Temperature: -40°C; Package Quantity: 3000; Max Operating Temperature: 125°C; Operating Supply Current: 8mA; Radiation Hardening: No; REACH SVHC: No SVHC; Number of Bits per Element: 1; Mount: Surface Mount; Number of Outputs: 1; Lead Free: Lead Free; Number of Pins: 5; Weight: 0.000353oz; Number of Output Lines: 1; Number of Elements: 1; Number of Input Lines: 1; Number of Bits: 1; Case/Package: SOT-23-5; Packaging: Tape and Reel; Max Supply Voltage: 5.5V; Number of Inputs: 1

## Sheet LoRaSubsystem.SchDoc
size A4; SheetNumber: 3; SheetTotal: 14
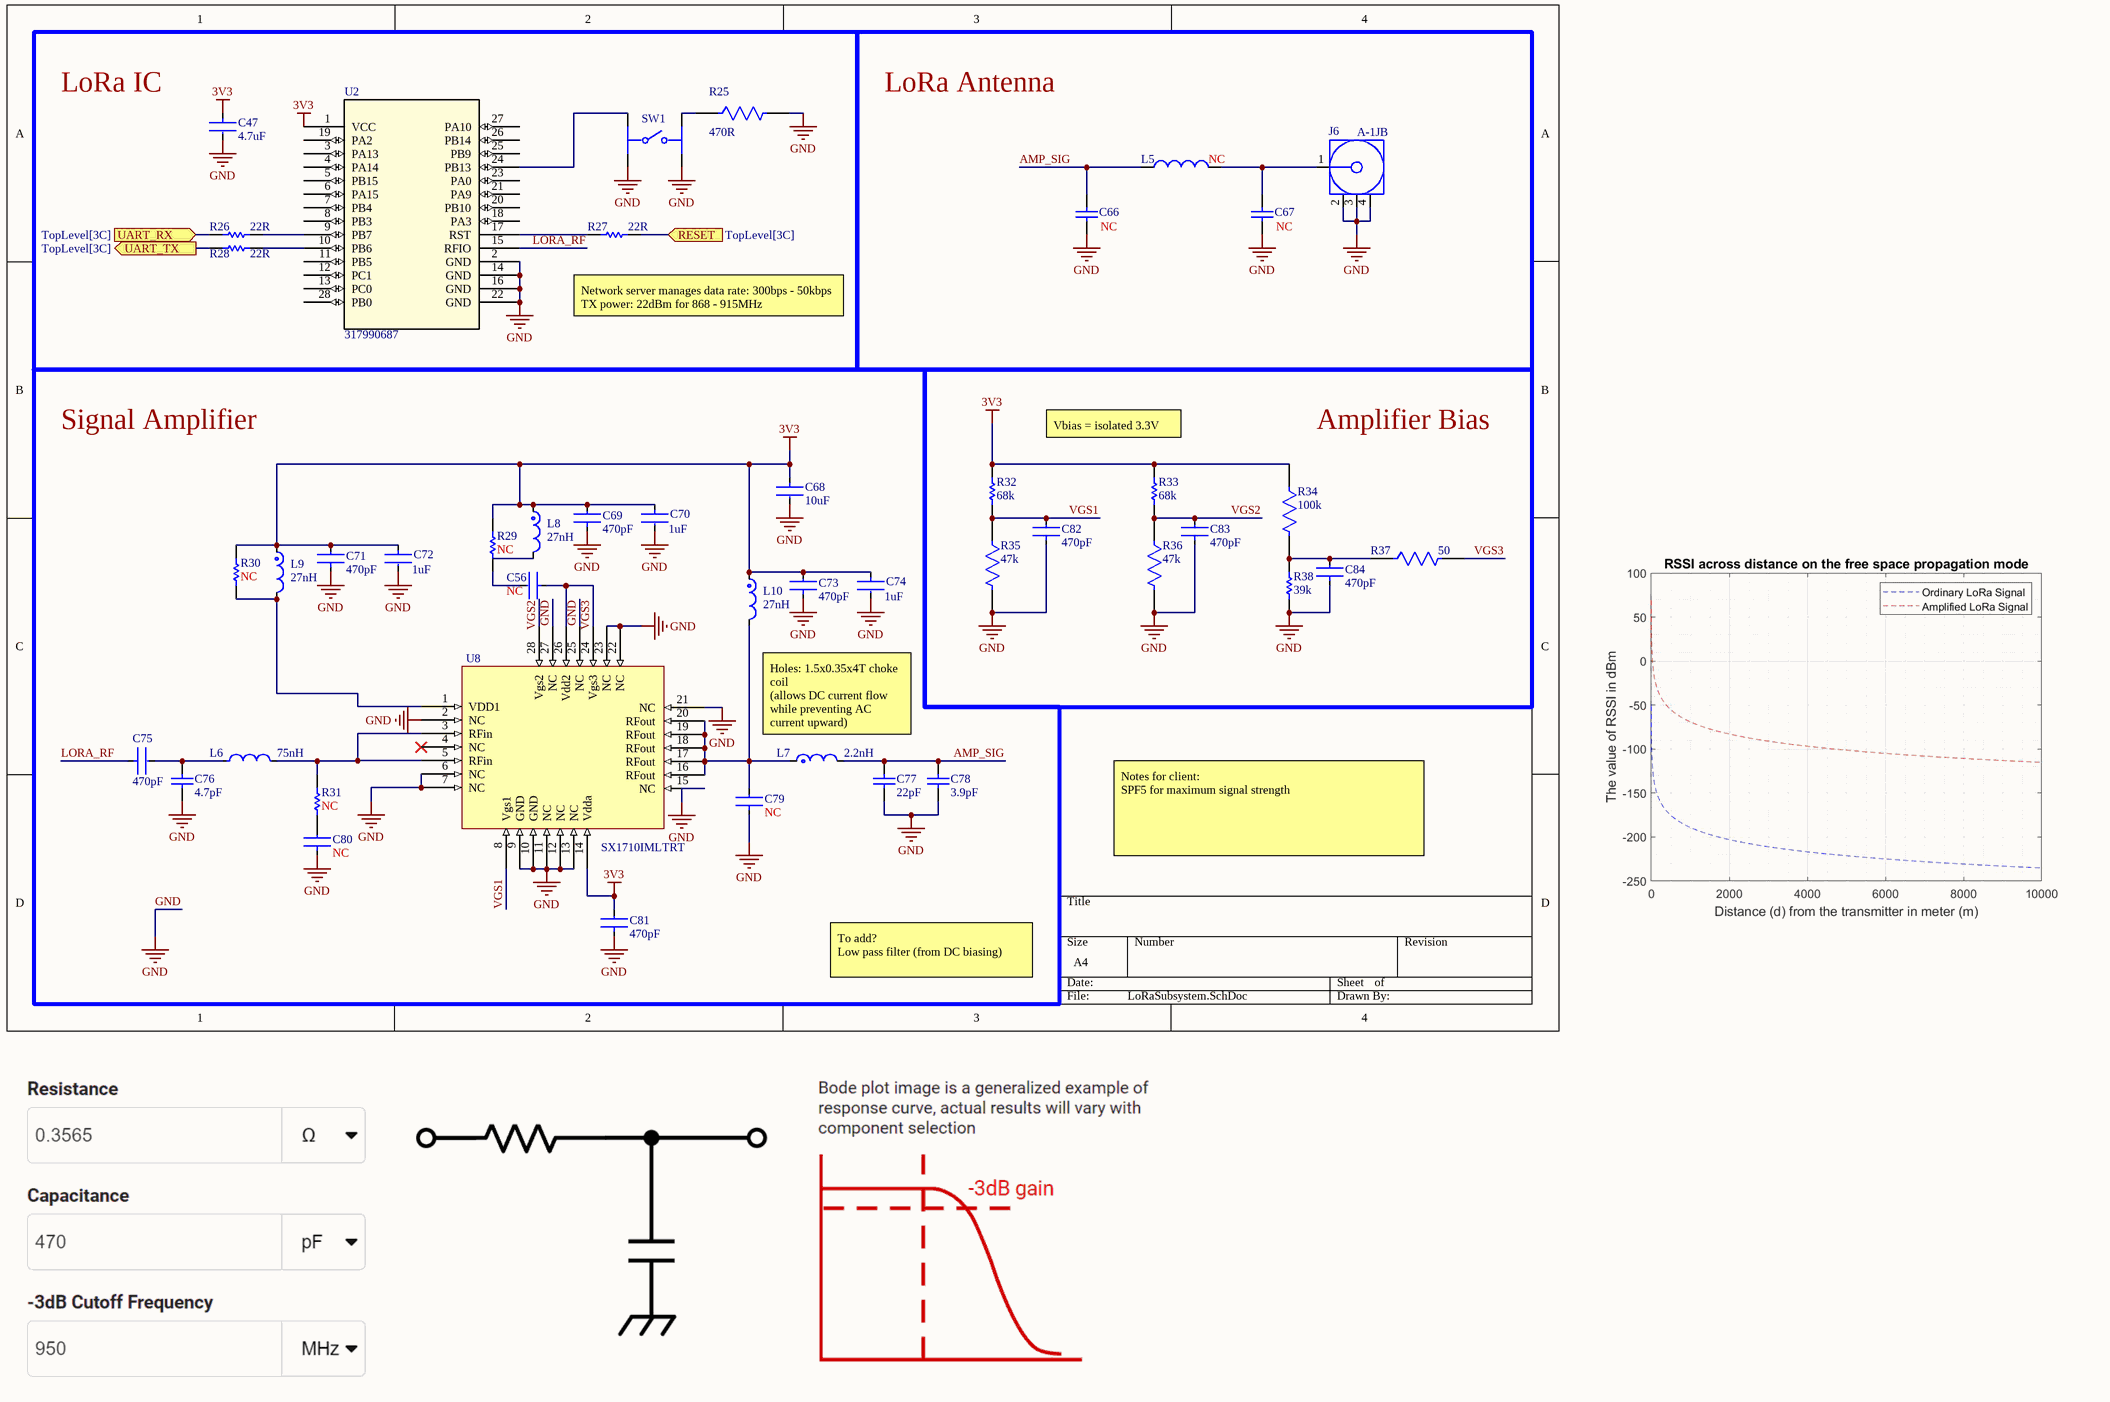
[diagram p5: LoRaSubsystem.SchDoc]

### Parts
C47  4.7uF  [FP-C1005-050-0_15-MFG]
C56  NC  [FP-C0603C-CF-MFG]
C66  NC  [CAPC1005X55X25LL05T10]
C67  NC  [CAPC1005X55X25LL05T10]
C68  10uF  [FP-GRM188-0_2-MFG]
C69  470pF  [FP-C0603C-CF-MFG]
C70  Capacitance: 1uF  [FP-CL511-IPC_C]  (hidden comment: CL05A105KP5NNNC)
C71  470pF  [FP-C0603C-CF-MFG]
C72  Capacitance: 1uF  [FP-CL511-IPC_C]  (hidden comment: CL05A105KP5NNNC)
C73  470pF  [FP-C0603C-CF-MFG]
C74  Capacitance: 1uF  [FP-CL511-IPC_C]  (hidden comment: CL05A105KP5NNNC)
C75  470pF  [FP-C0603C-CF-MFG]
C76  4.7pF  [CAPC1006X50X20LL10T10]
C77  22pF  [CAPC1005X55X25NL05T10]
C78  3.9pF  [CAPC1006X50X20ML10T10]
C79  NC  [FP-C0603C-CF-MFG]
C80  NC  [FP-C0603C-CF-MFG]
C81  470pF  [FP-C0603C-CF-MFG]
C82  470pF  [FP-C0603C-CF-MFG]
C83  470pF  [FP-C0603C-CF-MFG]
C84  470pF  [FP-C0603C-CF-MFG]
J6  A-1JB  [AMPH-A-1JB_V]
L5  NC  [INDC1608X90X30LL10T20]
L6  75nH  [FP-LQW15AN_00-W0_5-0_1-MFG]
L7  2.2nH  [FP-LQG18HH_00-IPC_A]
L8  27nH  [FP-LQG15HH_02-IPC_C]
L9  27nH  [FP-LQG15HH_02-IPC_C]
L10  27nH  [FP-LQG15HH_02-IPC_C]
R25  470R  [FP-CRCW0402-e3-MFG]
R26  22R  [RESC1005X40X25LL05T05]
R27  22R  [RESC1005X40X25LL05T05]
R28  22R  [RESC1005X40X25LL05T05]
R29  NC  [RESC1609X50X30NL8T20]
R30  NC  [RESC1609X50X30NL8T20]
R31  NC  [RESC1609X50X30NL8T20]
R32  68k  [RESC2013X70X40NL20T20]
R33  68k  [RESC2013X70X40NL20T20]
R34  100k  [FP-ERA3A-IPC_A]
R35  47k  [FP-ERA6A-IPC_A]
R36  47k  [FP-ERA6A-IPC_A]
R37  50  [FP-FC0402-IPC_C]
R38  39k  [RESC1005X40X25LL05T05]
SW1  PTS645SM43SMTR92LFS  [FP-PTS645SM43SMTR92LFS-MFG]  (value not drawn)
U2  317990687  [QFN_90687_SEE]
U8  SX1710IMLTRT  [QFN50P500X500X100_HS-29N]

### Blocks framed on the sheet
LoRa IC: C47 R25-R28 SW1 U2
LoRa Antenna: C66 C67 J6 L5
Signal Amplifier: C56 C68-C81 L6-L10 R29-R31 U8
Amplifier Bias: C82-C84 R32-R38

### Ports
RESET (in, see TopLevel[3C]), UART_RX (in, see TopLevel[3C]), UART_TX (out, see TopLevel[3C])

### Nets
3V3: C47.1 C68.1 C69.2 C70.1 C71.2 C72.1 C73.2 C74.1 C81.2 L8.1 L9.1 L10.1 R29.2 R30.2 R32.2 R33.2 R34.1 U2.1(VCC) U8.14(Vdda)  [project net GPIO_VDD]
GND: C47.2 C66.1 C67.1 C68.2 C69.1 C70.2 C71.1 C72.2 C73.1 C74.2 C76.1 C77.1 C78.1 C79.1 C80.1 C81.1 C82.1 C83.1 C84.1 J6.2 J6.3 J6.4 R25.2 R35.2 R36.2 R38.2 SW1.2 SW1.4 U2.2(GND) U2.14(GND) U2.16(GND) U2.22(GND) U8.2(NC) U8.6(NC) U8.7(NC) U8.9(GND) U8.10(GND) U8.11(NC) U8.12(NC) U8.13(NC) U8.15(NC) U8.21(NC) U8.22(NC) U8.23(NC) U8.25(NC) U8.27(NC)
AMP_SIG: C66.2 C77.2 C78.2 L5.1 L7.2
LORA_RF: C75.1 U2.15(RFIO)
VGS1: C82.2 R32.1 R35.1 U8.8(Vgs1)
VGS2: C83.2 R33.1 R36.1 U8.28(Vgs2)
VGS3: C56.1 R37.2 U8.24(Vgs3) U8.26(Vdd2)
NetC56_2: C56.2 R29.1
NetC67_2: C67.2 J6.1 L5.2
NetC75_2: C75.2 C76.2 L6.1
NetC79_2: C79.2 L7.1 L10.2 U8.16(RFout) U8.17(RFout) U8.18(RFout) U8.19(RFout) U8.20(RFout)
NetC80_2: C80.2 R31.1
NetC84_2: C84.2 R34.2 R37.1 R38.1
NetL6_2: L6.2 R31.2 U8.3(RFin) U8.5(RFin)
NetL9_2: L9.2 R30.1 U8.1(VDD1)
NetR25_1: R25.1 SW1.1
NetR26_1: R26.1 ; port UART_RX
NetR26_2: R26.2 U2.9(PB7)
NetR27_1: R27.1 U2.17(RST)
NetR27_2: R27.2 ; port RESET
NetR28_1: R28.1 ; port UART_TX
NetR28_2: R28.2 U2.10(PB6)
NetSW1_3: SW1.3 U2.24(PB13)

Not connected (* = marked no-connect by the designer): L8 2; U2 3(PA13) 4(PA14) 5(PB15) 6(PA15) 7(PB4) 8(PB3) 11(PB5) 12(PC1) 13(PC0) 18(PA3) 19(PA2) 20(PB10) 21(PA9) 23(PA0) 25(PB9) 26(PB14) 27(PA10) 28(PB0); U8 4(NC)*

### Notes on the sheet
- (near R27) Network server manages data rate: 300bps - 50kbps
  TX power: 22dBm for 868 - 915MHz
- (near R33) Vbias = isolated 3.3V
- Holes: 1.5x0.35x4T choke coil
  (allows DC current flow while preventing AC current upward)
- Notes for client:
  SPF5 for maximum signal strength
- To add?
  Low pass filter (from DC biasing)

### Library data of the parts
C47 = CMP-2000-05997-2: C1005X5R1A475K050BC; Dielectric Material: Ceramic; Tolerance: 10%; Voltage Rating (DC): 10V; Dielectric: X5R; Series: C; Package Quantity: 10000; Max Operating Temperature: 85°C; Case Code (Imperial): 0402; Lead Free: Lead Free; Packaging: Cut Tape; Voltage Rating: 10V; Min Operating Temperature: -55°C; Thickness: 0.022inch; Width: 0.02inch; Case/Package: 0402; Case Code (Metric): 1005; Capacitance: 4.7uF; Length: 0.039inch; RoHS Compliant: Yes; REACH SVHC: No SVHC; Mount: Surface Mount
C56 C79 C80 = CMP-2006-03816-2: C0603C471K5RACTU; Manufacturer: KEMET; Capacitance: 470 pF; Temperature Characteristic: X7R; Tolerance: 0.1; Temperature Coefficient: 30ppm/°C; Material: Ceramic; Automotive Grade: Grade 1; Value: 470 pF; Voltage Rating: 50 V; Manufacturer Part Number: C0603C471K5RACTU; Mouser Description: Ceramic Capacitor, 470Pf, 50V, X7R, 10%, 0603, Full Reel; Height: 0.87mm; Temperature: -55°C to +125°C; RoHS: TRUE; Lead Free: Yes; Category: Cap; ComponentLink2URL: https://api.kemet.com/component-edge/download/datasheet/C0603C100J5GACAUTO.pdf; Device Class L3: Ceramic Capacitors; Temperature Range High: +125°C; Package: C0603C-CF; Automotive: Yes; Device Class L2: Capacitors; Device Class L1: Passive Components; Digikey Description: CAP CER 470PF 50V X7R 0603; Temperature Range Low: -55°C; ComponentLink2Description: Datasheet; Octopart: https://octopart.com/c0603c471k5ractu-kemet-89311
C66 C67 = CMP-2008-04368-1: GRM1555C1H470JA01D; Manufacturer: Murata; Part Number: GRM1555C1H470JA01D
C68 = CMP-06035-002932-1: as C23 on sheet MCUsubsystem; Case Code (Metric): 1608; Max Operating Temperature: 105°C; Voltage Rating (DC): 10V; Thickness: 0.031inch; Width: 0.031inch; Dielectric: X6S; Lead Free: Lead Free; REACH SVHC: No SVHC; Case/Package: 0603; Length: 0.063inch; Min Operating Temperature: -55°C; Package Quantity: 4000; Voltage Rating: 10V; Tolerance: 20%; Capacitance: 10uF; Packaging: Cut Tape; Material: Ceramic; Mount: Surface Mount; Case Code (Imperial): 0603; Height: 0.8mm
C69 C71 C73 C75 C81-C84 = CMP-2006-03816-2: C0603C471K5RACTU; Manufacturer: KEMET; Temperature Characteristic: X7R; Tolerance: 0.1; Temperature Coefficient: 30ppm/°C; Material: Ceramic; Automotive Grade: Grade 1; Voltage Rating: 50 V; Capacitance: 470 pF; Manufacturer Part Number: C0603C471K5RACTU; Mouser Description: Ceramic Capacitor, 470Pf, 50V, X7R, 10%, 0603, Full Reel; Height: 0.87mm; Temperature: -55°C to +125°C; RoHS: TRUE; Lead Free: Yes; Category: Cap; ComponentLink2URL: https://api.kemet.com/component-edge/download/datasheet/C0603C100J5GACAUTO.pdf; Device Class L3: Ceramic Capacitors; Temperature Range High: +125°C; Package: C0603C-CF; Automotive: Yes; Device Class L2: Capacitors; Device Class L1: Passive Components; Value: 470 pF; Digikey Description: CAP CER 470PF 50V X7R 0603; Temperature Range Low: -55°C; ComponentLink2Description: Datasheet; Octopart: https://octopart.com/c0603c471k5ractu-kemet-89311
C70 C72 C74 = CMP-13271-001936-1: as C24 on sheet MCUsubsystem; Depth: 0.5mm; Case Code (Imperial): 0402; Material: Ceramic; Mount: Surface Mount; Thickness: 0.022inch; Dielectric: X5R; Radiation Hardening: No; Case/Package: 0402; Length: 1mm; Tolerance: 10%; Max Operating Temperature: 85°C; Package Quantity: 1; Width: 0.02inch; Voltage Rating: 10V; Contact Plating: Tin; Height: 0.5mm; Min Operating Temperature: -55°C; Case Code (Metric): 1005; Packaging: Tape and Reel
C76 = CMP-2008-04810-1: 04023J4R7BBSTR; Manufacturer: AVX Interconnect / Elco; Part Number: 04023J4R7BBSTR
C77 = CMP-2008-04304-1: GRM1555C1H220JZ01D; Manufacturer: Murata; Part Number: GRM1555C1H220JZ01D
C78 = CMP-2008-04803-1: 04023J3R9BBSTR; Manufacturer: AVX Interconnect / Elco; Part Number: 04023J3R9BBSTR
J6 = CMP-1743-00001-1: AMC PCB Jack, 0 to 60 GHz, 60 V, -40 to 90 degC, 4-Pin SMD, RoHS, Tape and Reel; Capacitance: 100 uF; Case\Package: 2917; Voltage Rating (DC): 10 V; ESR: 700 mohm; Tolerance: 10%; ComponentLink1Description: Datasheet; PackageDescription: 4-Pin Surface Mount Device, Body 2.6 x 2.6 mm; Radiation Hardening: No; Package Quantity: 1; REACH SVHC: No SVHC; DatasheetVersion: Rev. K, 05/2016; ComponentLink1URL: http://drawings.amphenolrf.com/Customer_Outline/CA-1JB.pdf; Pins: 2; Packaging: Tape and Reel; Min Operating Temperature: -55 degC; RoHSCompliant: true; Length: 7.3 mm; PackageReference: A-1JB; Weight: 0.023634 oz; Mount: Surface Mount; Voltage Rating: 10 V; Max Operating Temperature: 125 degC; Height: 3.1 mm; Case Code (Imperial): 2917; Case Code (Metric): 7343; Width: 4.3 mm
L5 = CMP-2000-05913-1: B82496C3330J; Manufacturer: EPCOS-(TDK); Type: Wirewound; Q @ Freq: 14@100MHz; Inductance: 33nH; Shielding: Unshielded; Material - Core: Ceramic; Frequency - Self Resonant: 3GHz; DC Resistance (DCR): 600mOhmMax; Tolerance: ±5%; Frequency - Test: 100MHz; Current Rating: 350mA; Manufacturer URL: http://www.tdk.com/; Mounting Type: SurfaceMount; Mounting Technology: SurfaceMount; Height - Seated (Max): 0.035"(0.90mm); Datasheet URL: https://en.tdk.eu/inf/30/db/ind_2008/b82496c.pdf; Operating Temperature: -; Size / Dimension: 0.063"Lx0.031"W(1.60mmx0.80mm); Series: SIMID; Current - Saturation: -; Ratings: AEC-Q200; Packaging: CutTape(CT); Package Reference: 0603; Datasheet Version: 07/2016; Category: Inductors,Coils,Chokes; Package Description: 2-Pin Surface Mount Device, Body 1.6 x 0.8 mm; Family: FixedInductors; Package / Case: 0603(1608Metric)
L6 = CMP-06042-002714-1: LQW15AN75NG00D; Test Frequency: 100MHz; Shielding: Unshielded; Self Resonant Frequency: 2.4GHz; Tolerance: 2%; Core Material: Air; Q Factor: 20; Current Rating: 135mA; Current: 125mA; DC Resistance (DCR): 2.1R; Inductance: 75nH; Case Code (Metric): 1005; Package Quantity: 10000; Packaging: Tape and Reel; Mount: Surface Mount; Height: 0.5mm; Termination: SMD/SMT; Min Operating Temperature: -55°C; Weight: 2.8E-05oz; Lead Free: Lead Free; Length: 1mm; Case Code (Imperial): 0402; Max DC Current: 135mA; Width: 0.02inch; Military Standard: Not; Case/Package: 0402; Depth: 0.6mm; DC Current: 135mA; Max Operating Temperature: 125°C
L7 = CMP-06042-006288-1: LQG18HN2N2S00D; Max DC Current: 500mA; Core Material: Air; Self Resonant Frequency: 6GHz; Q Factor: 12; DC Resistance (DCR): 100mR; Shielding: Unshielded; Test Frequency: 100MHz; Inductance: 2.2nH; Depth: 0.95mm; Current Rating: 500mA; Packaging: Tape and Reel; Case/Package: 0603; Height - Seated (Max): 0.037inch; Mount: Surface Mount; Radiation Hardening: No; Max Operating Temperature: 85°C; Length: 0.063inch; Termination: SMD/SMT; Lead Free: Lead Free; Min Operating Temperature: -40°C; Number of Pins: 2; Case Code (Metric): 1608; Height: 0.8mm; REACH SVHC: No SVHC; Package Quantity: 4000; DC Current: 500mA; Width: 0.031inch; Military Standard: Not; Case Code (Imperial): 0603
L8-L10 = CMP-2000-06578-2: LQG15HS27NJ02D; DC Current: 300mA; Core Material: Air; Tolerance: 5%; Self Resonant Frequency: 1.7GHz; Q Factor: 8; DC Resistance (DCR): 460mR; Shielding: Unshielded; Test Frequency: 100MHz; Inductance: 27nH; Width: 0.02inch; Length: 1mm; Height - Seated (Max): 0.022inch; Military Standard: Not; Case Code (Imperial): 0402; Depth: 0.55mm; Current Rating: 300mA; Inductance Tolerance: 5%; Lead Free: Lead Free; Height: 0.5mm; Max DC Current: 300mA; REACH SVHC: No SVHC; Package Quantity: 10000; Mount: Surface Mount; Termination: SMD/SMT; Case Code (Metric): 1005; Case/Package: 0402; Max Operating Temperature: 125°C; Packaging: Tape and Reel; Min Operating Temperature: -55°C
R25 = CMP-2002-00022-2: CRCW0402470RFKED; Tolerance: 1%; Power Rating: 63mW; Voltage Rating (DC): 50V; Temperature Coefficient: 100ppm/°C; Case Code (Imperial): 0402; Lead Free: Lead Free; Max Operating Temperature: 155°C; Military Standard: Not; Height: 0.35mm; Termination: SMD/SMT; Mount: Surface Mount; Features: Automotive AEC-Q200; Composition: Thick Film; Case Code (Metric): 1005; Package Quantity: 10; Radiation Hardening: No; Max Power Dissipation: 63mW; Weight: 2.3E-05oz; Width: 0.5mm; Length: 1mm; Depth: 0.5mm; Min Operating Temperature: -55°C; Voltage Rating: 50V; Case/Package: 0402; Packaging: Tape and Reel; Contact Plating: Tin; Resistance: 470R; Number of Terminations: 2
R26-R28 = CMP-2002-08382-1: CRCW040222R0FKED; Manufacturer: Vishay Dale; Part Number: CRCW040222R0FKED
R29-R31 = CMP-1666-00005-4: CRCW060310K0FKEA; Manufacturer: Vishay Semiconductor; Voltage Rating: 75 V; Max Operating Temperature: 155 degC; PackageDescription: 2-Pin Surface Mount Device, Body 1.575 x 0.85 mm; ComponentLink1Description: Manufacturer URL; RoHSCompliant: true; PackageReference: 0603; REACH SVHC: Unknown; Length: 1.55 mm; DatasheetVersion: 06/2012; Packaging: Tape and Reel; Min Operating Temperature: -55 degC; Mounting Technology: Surface Mount; ComponentLink2URL: https://datasheet.ciiva.com/11809/0900766b80d98afc-11809037.pdf; Height: 0.45 mm; ComponentLink2Description: Datasheet; Package Quantity: 5000; ComponentLink1URL: http://www.vishay.com/
R32 R33 = CMP-2001-00568-1: ERJ6ENF6802V; Manufacturer: Panasonic; Part Number: ERJ6ENF6802V
R34 = CMP-2000-00875-2: ERA-3AEB104V; NexarPartId: 1243428; Power Rating: 100mW; Voltage Rating (DC): 75V; Tolerance: 0.1%; Temperature Coefficient: 25ppm/°C; Resistance: 100kΩ; Contact Plating: Tin; Max Operating Temperature: 155°C; Case Code (Imperial): 0603; Packaging: Cut Tape; Width: 800µm; Lead Free: Lead Free; REACH SVHC: No SVHC; Termination: SMD/SMT; Radiation Hardening: No; Length: 1.6mm; Military Standard: Not; Features: Automotive AEC-Q200; Case/Package: 0603; Number of Terminations: 2; Composition: Thin Film; Schedule B: 8533210045, 8533210045; Voltage Rating: 75V; Mount: Surface Mount; Case Code (Metric): 1608; Lifecycle Status: Production; Height: 450µm; RoHS: Compliant; Number of Pins: 2; Max Power Dissipation: 100mW; Min Operating Temperature: -55°C; Depth: 800µm; Working Voltage: 75V
R35 R36 = CMP-2001-00645-2: ERA-6AEB473V; NexarPartId: 1264112; Voltage Rating (DC): 100V; Max Power Dissipation: 125mW; Resistance: 47kΩ; Temperature Coefficient: 25ppm/°C; Tolerance: 0.1%; Case Code (Metric): 2012; Packaging: Cut Tape; Number of Terminations: 2; Max Operating Temperature: 155°C; Height: 500µm; Number of Pins: 2; Min Operating Temperature: -55°C; RoHS: Compliant; Features: Automotive AEC-Q200; Schedule B: 8533210045, 8533210045; Contact Plating: Tin; Case Code (Imperial): 0805; Lead Free: Lead Free; Lifecycle Status: Production; Termination: SMD/SMT; Weight: 5.499807mg; REACH SVHC: No SVHC; Voltage Rating: 100V; Mount: Surface Mount; Radiation Hardening: No; Military Standard: Not; Power Rating: 125mW; Length: 2mm; Depth: 1.25mm; Width: 1.25mm; Composition: Metal Film, Thin Film; Case/Package: 0805
R37 = CMP-02407-013075-1: FC0402E50R0BTBST1; Frequency: 20GHz; Voltage Rating (DC): 30V; Resistance: 50R; Resistance Tolerance: 0.1%; Power Rating: 50mW; Temperature Coefficient: 25ppm/°C; Resistor Type: Thin Film; Max Operating Temperature: 155°C; Case Code (Metric): 1005; Number of Terminations: 2; Height: 0.015inch; Min Operating Temperature: -55°C; Packaging: Tape and Reel; Package Quantity: 1; Radiation Hardening: No; Case Code (Imperial): 0402; Termination: SMD/SMT; Case/Package: 0402; Series: FC; Number of Pins: 2; Tolerance: 0.1%; Width: 0.022inch; Length: 0.042inch; Max Power Dissipation: 50mW; Voltage Rating: 30V; RoHS Compliant: Yes
R38 = CMP-2002-08569-1: CRCW040239K0FKED; Manufacturer: Vishay Dale; Part Number: CRCW040239K0FKED
SW1 = CMP-2000-05160-2: SWITCH TACTILE SPST-NO 0.05A 12V; Contact Resistance: 100mR; Throw Configuration: SPST; Illumination Type: Non-Illuminated; Mechanical Life: 100000Cycles; Current Rating: 50mA; Switch Function: Off-Mom; Actuator Length: 0.85mm; Actuator Material: Nylon; Actuator Type: Standard; Operating Force: 160gf; Min Operating Temperature: -20°C; REACH SVHC: No SVHC; Termination: Gull Wing; Case/Package: SMD/SMT; Packaging: Tape and Reel; Mount: Surface Mount; Voltage Rating (DC): 12V; Orientation: Straight; Lead Free: Lead Free; Contact Material: Silver; Color: Black; Max Current Rating: 50mA; Contact Plating: Silver; Depth: 9mm; Package Quantity: 1; Max Voltage Rating (DC): 12V; Length: 6mm; Max Operating Temperature: 60°C
U2 = 317990687: No Description Available; Mfr_Name: BeagleBoard; RefDes: RefDes; Type: Type
U8 = CMP-00025-00003-2: Broadband High Efficiency RF Power Amplifier; Frequency: 1GHz; Voltage Rating: 5V; Max Operating Temperature: -45°C; Min Operating Temperature: 80°C; Case/Package: QFN-28; Pins: 28; Mounting Technology: SMD